# EasyEDA Pro project ProPrj_小中心板_2025-08-09.epro, schematic Schematic2
Board Name: Board2; Create Date: 2024-12-31; Page Name: P1; Project Name: 云台新滑环; Schematic Name: Schematic2; Update Date: 2024-12-31; Company: 嘉立创EDA; Page Size: A4; Version: V1.0
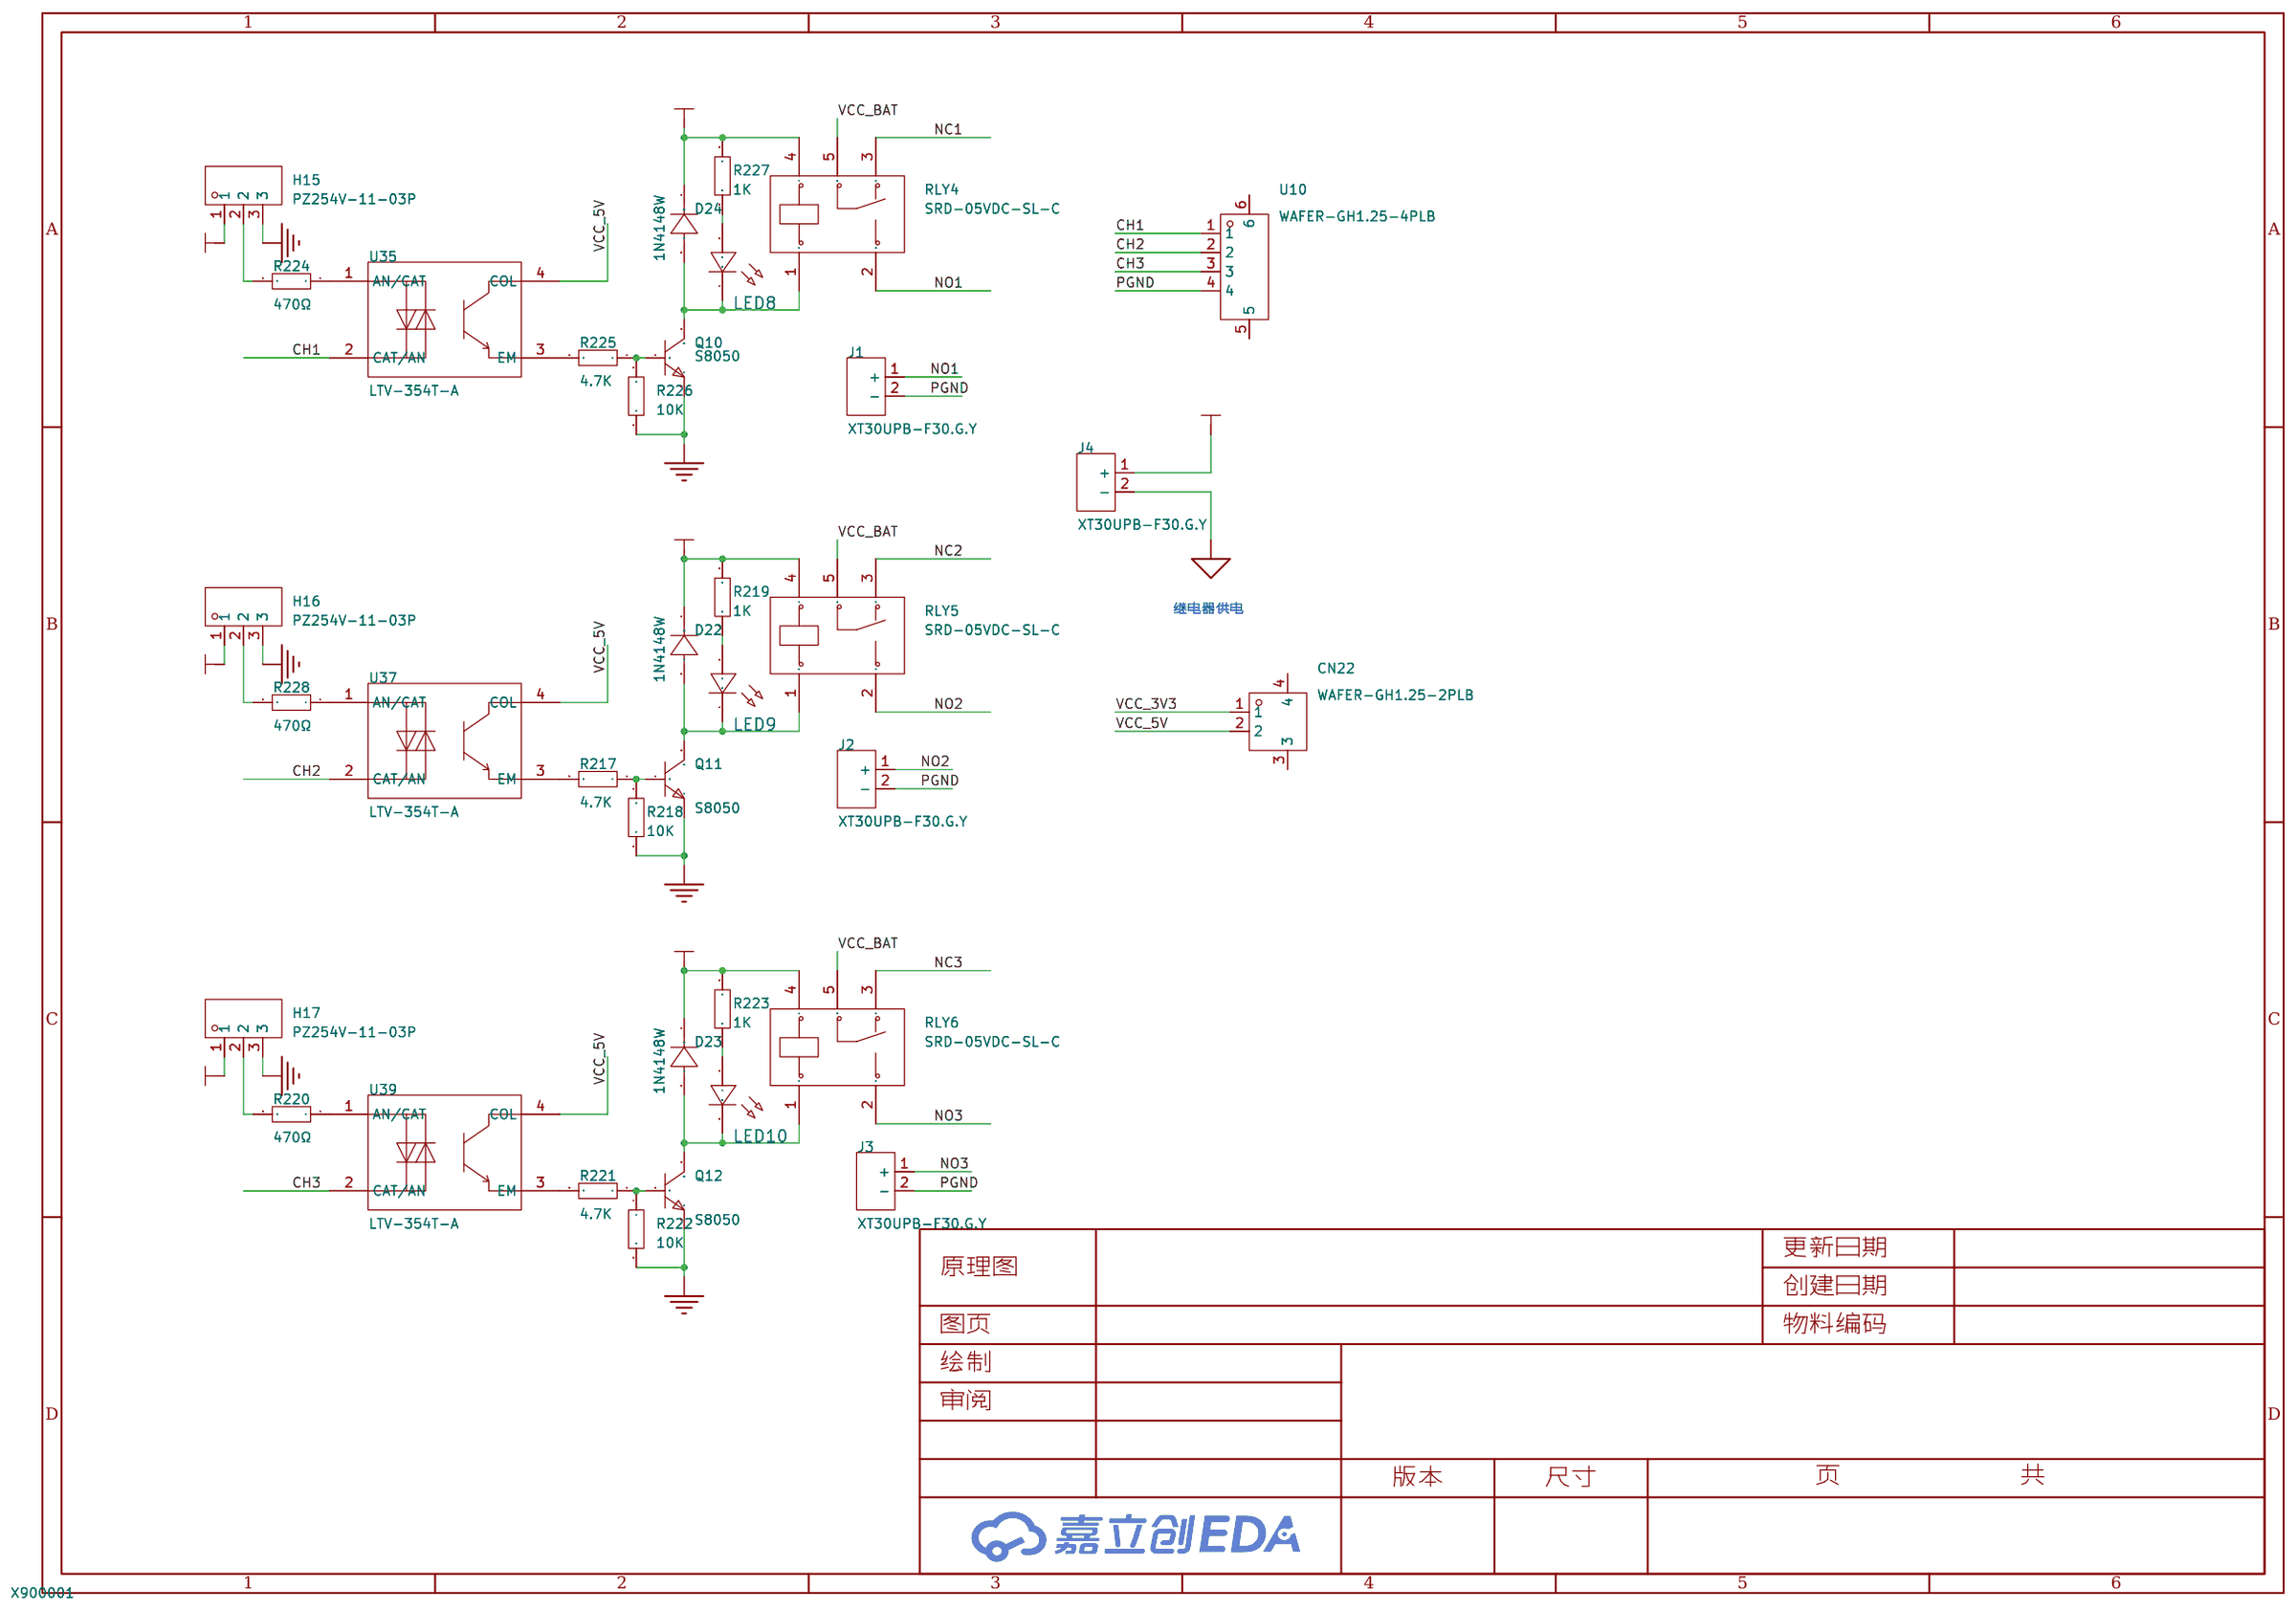
[diagram p4: schematic sheet]

## Parts
CN22  WAFER-GH1.25-2PLB  [CONN-TH_2P-P1.25_XUNPU_WAFER-GH1.25-2PLB]
D22  1N4148W  [SOD-123_L2.8-W1.8-LS3.7-RD-1]
D23  1N4148W  [SOD-123_L2.8-W1.8-LS3.7-RD-1]
D24  1N4148W  [SOD-123_L2.8-W1.8-LS3.7-RD-1]
H15  PZ254V-11-03P  [HDR-TH_3P-P2.54-V-M]
H16  PZ254V-11-03P  [HDR-TH_3P-P2.54-V-M]
H17  PZ254V-11-03P  [HDR-TH_3P-P2.54-V-M]
J1  XT30UPB-F30.G.Y  [CONN-TH_XT30UPB-F]
J2  XT30UPB-F30.G.Y  [CONN-TH_XT30UPB-F]
J3  XT30UPB-F30.G.Y  [CONN-TH_XT30UPB-F]
J4  XT30UPB-F30.G.Y  [CONN-TH_XT30UPB-F]
LED8  -  [LED_0603]
LED9  -  [LED_0603]
LED10  -  [LED_0603]
Q10  S8050  [SOT-23-3_L2.9-W1.3-P1.90-LS2.4-BR]
Q11  S8050  [SOT-23-3_L2.9-W1.3-P1.90-LS2.4-BR]
Q12  S8050  [SOT-23-3_L2.9-W1.3-P1.90-LS2.4-BR]
R217  4.7K  [R0603]
R218  10K  [R0603]
R219  1K  [R0603]
R220  470Ω  [R0603]
R221  4.7K  [R0603]
R222  10K  [R0603]
R223  1K  [R0603]
R224  470Ω  [R0603]
R225  4.7K  [R0603]
R226  10K  [R0603]
R227  1K  [R0603]
R228  470Ω  [R0603]
RLY4  SRD-05VDC-SL-C  [RELAY-TH_SRD-XXVDC-XL-C]
RLY5  SRD-05VDC-SL-C  [RELAY-TH_SRD-XXVDC-XL-C]
RLY6  SRD-05VDC-SL-C  [RELAY-TH_SRD-XXVDC-XL-C]
U10  WAFER-GH1.25-4PLB  [CONN-SMD_4P-P1.25_XUNPU_WAFER-GH1.25-4PLB]
U35  LTV-354T-A  [SOP-4_L3.9-W4.4-P2.54-LS7.0-TL]
U37  LTV-354T-A  [SOP-4_L3.9-W4.4-P2.54-LS7.0-TL]
U39  LTV-354T-A  [SOP-4_L3.9-W4.4-P2.54-LS7.0-TL]

## Library data of the parts
CN22 = WAFER-GH1.25-2PLB: 插针结构:1x2P;间距:1.25mm;安装方式:立贴;参考系列:GH;总PIN数:2P;排数:1;每排PIN数:2;额定电流:1A;工作温度范围:-25℃~+85℃;; LCSC Part Name: 1x2P 间距:1.25mm 立贴 系列:GH; Supplier Part: C3029368; Manufacturer: XUNPU(讯普); Supplier Footprint: SMD,P=1.25mm; JLCPCB Part Class: 扩展库; Datasheet: https://atta.szlcsc.com/upload/public/pdf/source/20220527/44F824AAC8C2B617205E15955FF9C23D.pdf; Supplier: LCSC; Pins Structure: 1x2P; Pitch: 1.25mm; Mounting Style: 立贴; Reference Series: GH; Number of Pins: 2P; Number of Rows: 1; Number of PINs Per Row: 2; Current Rating (Max): 1A; Operating Temperature Range: -25℃~+85℃
D22-D24 = 1N4148W_C917030: 二极管配置:独立式;正向压降(Vf):1.25V@150mA;直流反向耐压(Vr):100V;平均整流电流(Io):300mA;功率:400mW;反向恢复时间(trr):8ns;; LCSC Part Name: 电压:100V 电流:300mA; Supplier Part: C917030; Manufacturer: JSMSEMI(杰盛微); Supplier Footprint: SOD-123; JLCPCB Part Class: 扩展库; Datasheet: https://atta.szlcsc.com/upload/public/pdf/source/20230807/C928F35F082AC22834996B2570733516.pdf; Supplier: LCSC; Diode Configuration: 独立式; Forward Voltage (Vf@If): 1.25V@150mA; Reverse Voltage (Vr): 100V; Average Rectified Current (Io): 300mA; Power Dissipation: 400mW; Reverse Leakage Current: 1uA@75V; Reverse Recovery Time (trr): 8ns; Operating Temperature: -55℃~+150℃@(Tj)
H15-H17 = PZ254V-11-03P: 插针结构:1x3P;间距:2.54mm;行距:-;圆针/方针:方针;安装类型:直插;排数:单排;总PIN位数:3P;额定电流:3A;额定电压:250V;配合针长度:6mm;塑高:2.5mm;端接针长度:3mm;工作温度范围:-40℃~+105℃;颜色:黑色;; LCSC Part Name: 间距:2.54mm 1x3P 直插 方针; Supplier Part: C2937625; Manufacturer: XFCN(兴飞); Supplier Footprint: 插件,P=2.54mm; JLCPCB Part Class: Extended Part; Datasheet: https://atta.szlcsc.com/upload/public/pdf/source/20200309/C492402_8335C3D49C4E4C618838D59BB1D024C1.pdf; Supplier: LCSC; Pin Structure: 1x3P; Pitch: 2.54mm; Circluar Pins/Square Pins: 方针; Mounting Type: 直插; Number of Rows: 单排; Number of Pins: 3P; Current Rating (Max): 3A; Voltage Rating (Max): 250V; Length of Mating Pin: 6mm; Insulation Height: 2.5mm; Length of End Connection Pin: 3mm; Operating Temperature Range: -40℃~+105℃; Color: 黑色
J1-J4 = XT30UPB-F30.G.Y: 类别:-;类型1:-;; LCSC Part Name: AMASS(艾迈斯)直立焊板式连接器XT30UPB30-F.G.*; Supplier Part: C108769; Manufacturer: AMASS(艾迈斯); JLCPCB Part Class: 扩展库; Datasheet: https://atta.szlcsc.com/upload/public/pdf/source/20220715/AFD68B9E8B6CA95A7295DBF4AF9325E4.pdf; Supplier: LCSC; Brand: 艾迈斯; Type: 航模插头; Colour: 黄色; RatedVoltage: DC 500V; InterfaceType: 母头; MetalMaterial: 镀金; InsulationMaterial: PA; RatedCurrent: 15A; contact resistance: 0.65mΩ
LED8-LED10 = LED_0603-R: Supplier Footprint: 0603
Q10-Q12 = S8050_C2891804: 晶体管类型:NPN;集电极电流(Ic):500mA;集射极击穿电压(Vceo):25V;功率(Pd):300mW;; LCSC Part Name: NPN 电流:500mA 耐压:25V; Supplier Part: C2891804; Manufacturer: YONGYUTAI(永裕泰); Supplier Footprint: SOT-23; JLCPCB Part Class: 扩展库; Datasheet: https://atta.szlcsc.com/upload/public/pdf/source/20210901/5347316A10609C628D4D69AE01446E5B.pdf; Supplier: LCSC; Transistor Type: NPN; Collector Current (Ic): 500mA; Collector-Emitter Breakdown Voltage (Vceo): 25V; Power Dissipation (Pd): 300mW; Collector Cut-Off Current (Icbo): 1uA; Collector-Emitter Saturation Voltage (VCE(sat)@Ic,Ib): 500mV@500mA,50mA
R217-R228 = Res_0603: Supplier Footprint: 0603
RLY4-RLY6 = SRD-05VDC-SL-C: 线圈电压:5V;触点形式:一组转换:1C(单刀双掷-转换);触点容量(电阻负载):-;最大切换电压:250V@AC;最大切换电流:15A;; LCSC Part Name: 蓝色; Supplier Part: C35449; Manufacturer: 松乐; Supplier Footprint: 插件,15.6x19.2mm; JLCPCB Part Class: 扩展库; Datasheet: https://atta.szlcsc.com/upload/public/pdf/source/20200305/C490149_C96E4098A3B1FFB377D5AD2E40B7C2A8.pdf; Supplier: LCSC; Coil Voltage: 5V; Contact Form: 一组转换:1C(单刀双掷-转换); Pin Number: 5; Maximum Switching Voltage: 250V@AC; Coil Rated Power: 360mW; Maximum Switching Current: 15A; Coil Type: 无极性-单线圈; Coil Resistance: 70Ω; Contact Resistance: 100mΩ; Operate Time: 10ms; Release Time: 10ms
U10 = WAFER-GH1.25-4PLB: 插针结构:1x4P;间距:1.25mm;安装方式:立贴;参考系列:GH;总PIN数:4P;排数:1;每排PIN数:4;额定电流:1A;工作温度范围:-25℃~+85℃;; LCSC Part Name: 1x4P 间距:1.25mm 立贴 系列:GH; Supplier Part: C3029370; Manufacturer: XUNPU(讯普); Supplier Footprint: SMD,P=1.25mm; JLCPCB Part Class: 扩展库; Datasheet: https://atta.szlcsc.com/upload/public/pdf/source/20220527/44F824AAC8C2B617205E15955FF9C23D.pdf; Supplier: LCSC; Pins Structure: 1x4P; Pitch: 1.25mm; Mounting Style: 立贴; Reference Series: GH; Number of Pins: 4P; Number of Rows: 1; Number of PINs Per Row: 4; Current Rating (Max): 1A; Operating Temperature Range: -25℃~+85℃
U35 U37 U39 = LTV-354T-A: 输入电压类型:AC,DC;正向电压:1.2V;输出电流:50mA;隔离电压(rms):3.75kV;反向电压:-;接收端电压:35V;输出通道数:1;集射极饱和电压(Vce(sat)@Ic,IF):100mV@1mA,20mA;; LCSC Part Name: AC,DC输入 隔离电压(rms):3750V; Supplier Part: C10802; Manufacturer: LITEON(光宝); Supplier Footprint: SOP-4-2.54mm; JLCPCB Part Class: 扩展库; Datasheet: https://atta.szlcsc.com/upload/public/pdf/source/20170807/C119090_1502077835934868429.pdf; Supplier: LCSC; Input voltage type: AC,DC; Output Type: 光电三极管; Forward Voltage: 1.2V; Output Current: 50mA; Isolation Voltage(rms): 3.75kV; Receiving End Voltage: 35V; Number of Outputs: 1; Collector-Emitter Saturation Voltage (Vce(sat)@Ic,IF): 100mV@1mA,20mA; Rise time: 4us@2mA,100Ω; Fall time: 3us@2mA,100Ω; Operating Temperature: -55℃~+100℃

## Nets
PGND: H15.3 H16.3 H17.3 J1.2(-) J2.2(-) J3.2(-) J4.2(-) Q10.2(E) Q11.2(E) Q12.2(E) R218.2 R222.2 R226.2 U10.4
VCC_3V3: CN22.1 H15.1 H16.1 H17.1
VCC_5V: CN22.2 D22.1(C) D23.1(C) D24.1(C) R219.1 R223.1 R227.1 RLY4.4 RLY5.4 RLY6.4 U35.4(COL) U37.4(COL) U39.4(COL)
VCC_BAT: J4.1(+) RLY4.5 RLY5.5 RLY6.5
CH1: U10.1 U35.2(CAT/AN)
CH2: U10.2 U37.2(CAT/AN)
CH3: U10.3 U39.2(CAT/AN)
NC1: RLY4.3
NC2: RLY5.3
NC3: RLY6.3
NO1: J1.1(+) RLY4.2
NO2: J2.1(+) RLY5.2
NO3: J3.1(+) RLY6.2
$1N1348: R225.2 U35.3(EM)
$1N1351: R224.1 U35.1(AN/CAT)
$1N1352: Q10.1(B) R225.1 R226.1
$1N1355: D24.2(A) LED8.1(C) Q10.3(C) RLY4.1
$1N1356: LED8.2(A) R227.2
$1N1359: H15.2 R224.2
$1N1374: R217.2 U37.3(EM)
$1N1377: R228.1 U37.1(AN/CAT)
$1N1378: Q11.1(B) R217.1 R218.1
$1N1381: D22.2(A) LED9.1(C) Q11.3(C) RLY5.1
$1N1382: LED9.2(A) R219.2
$1N1385: H16.2 R228.2
$1N1400: R221.2 U39.3(EM)
$1N1403: R220.1 U39.1(AN/CAT)
$1N1404: Q12.1(B) R221.1 R222.1
$1N1407: D23.2(A) LED10.1(C) Q12.3(C) RLY6.1
$1N1408: LED10.2(A) R223.2
$1N1411: H17.2 R220.2

Not connected (* = marked no-connect by the designer): CN22 3 4; U10 5 6

## Notes on the sheet
- 继电器供电
